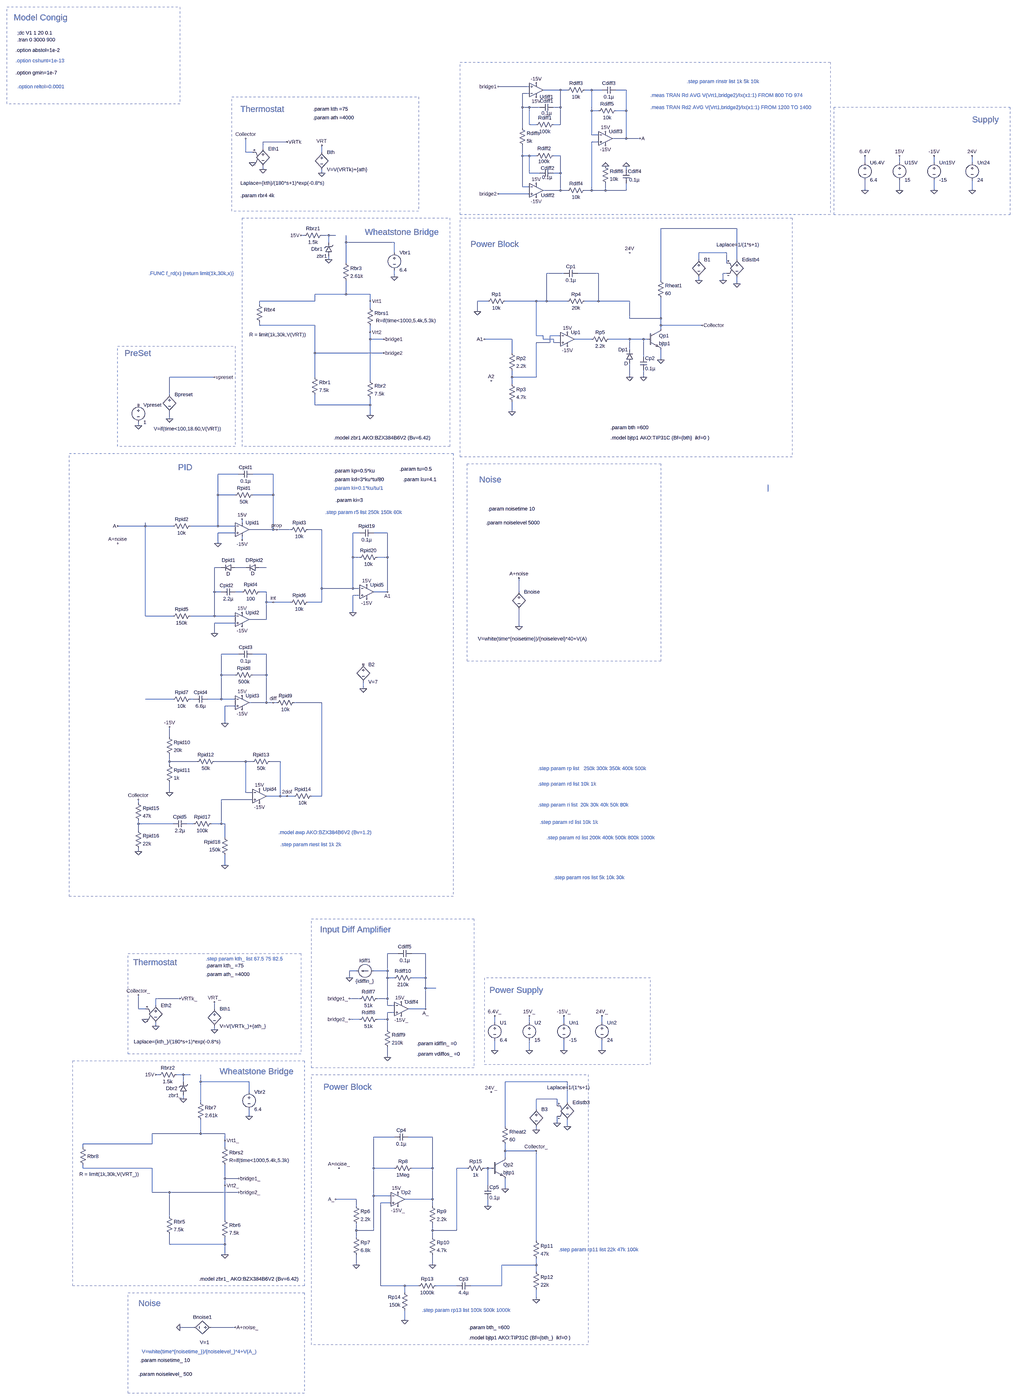
[diagram p0: schematic pid_temp1.asc, whole sheet]
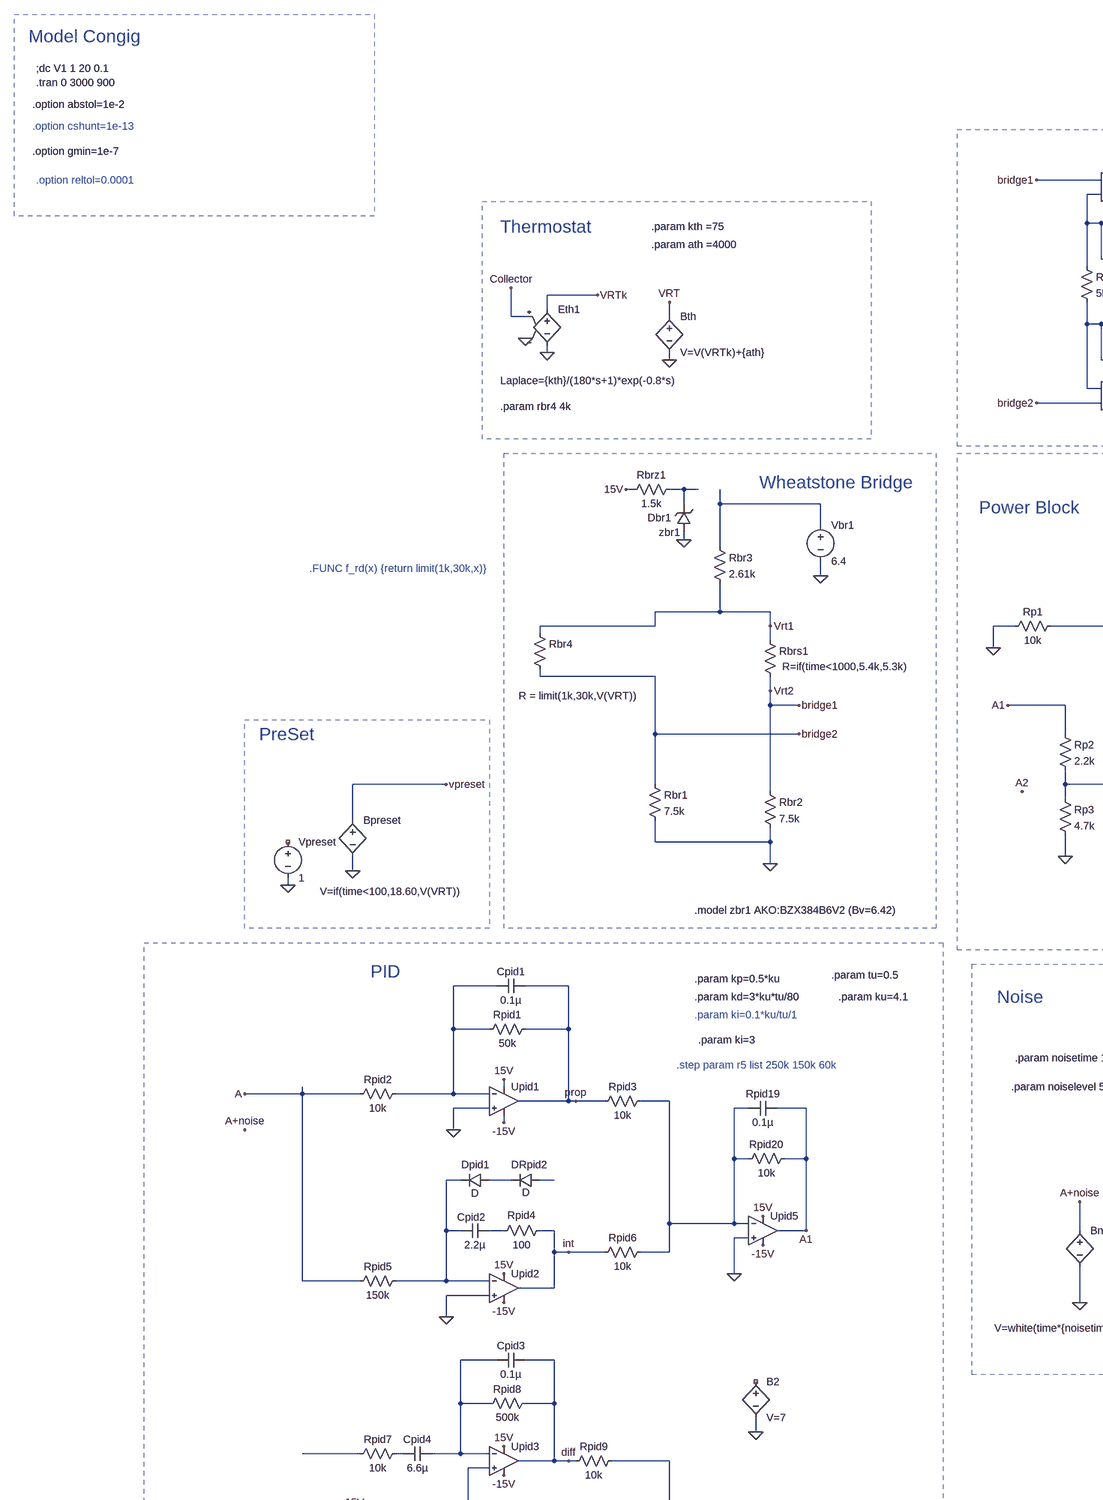
[diagram p1: schematic pid_temp1.asc, part, row 1 of 2, column 1 of 2]
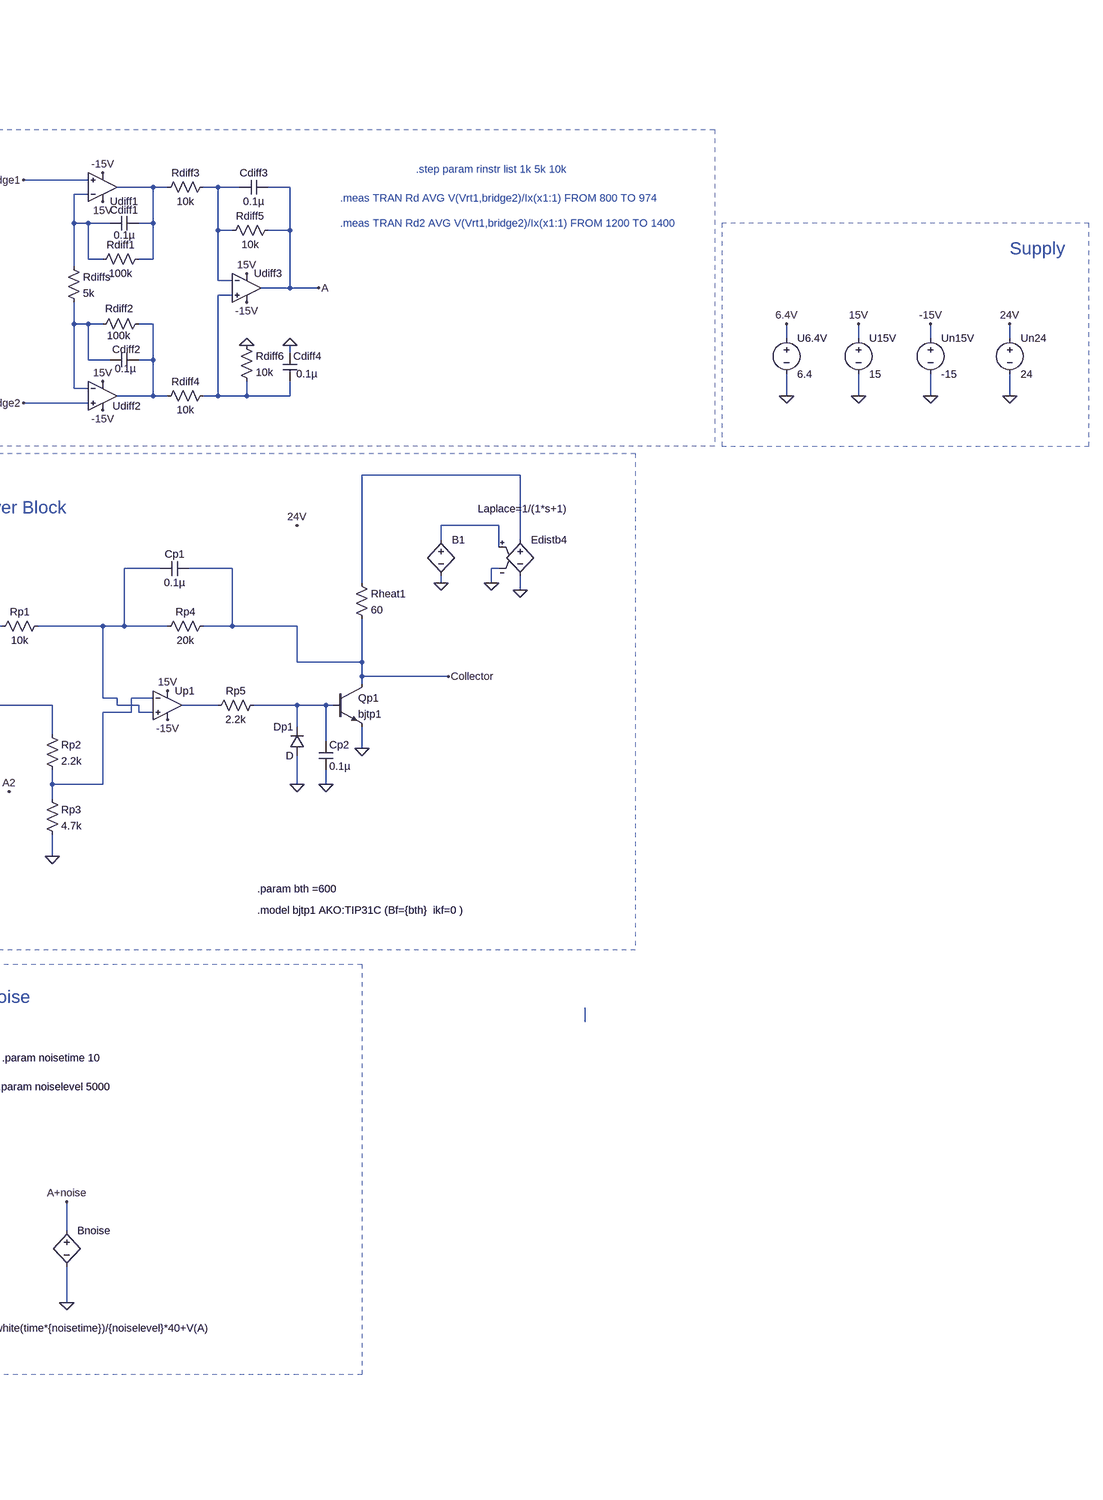
[diagram p2: schematic pid_temp1.asc, part, row 1 of 2, column 2 of 2]
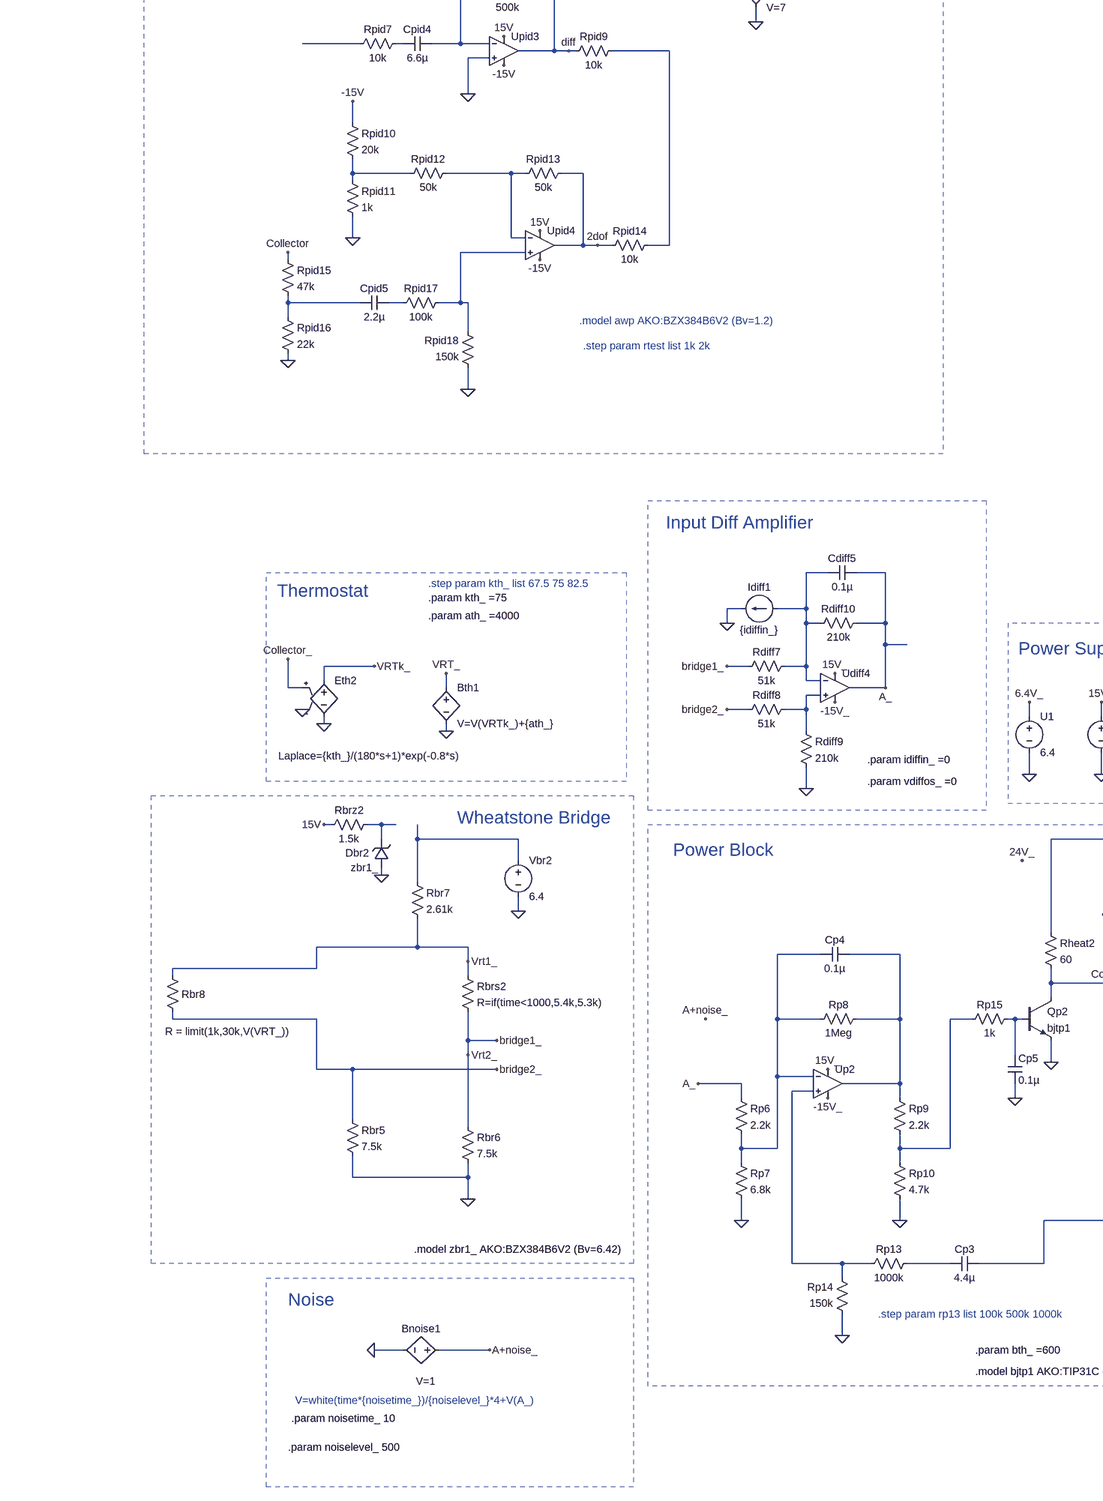
[diagram p3: schematic pid_temp1.asc, part, row 2 of 2, column 1 of 2]
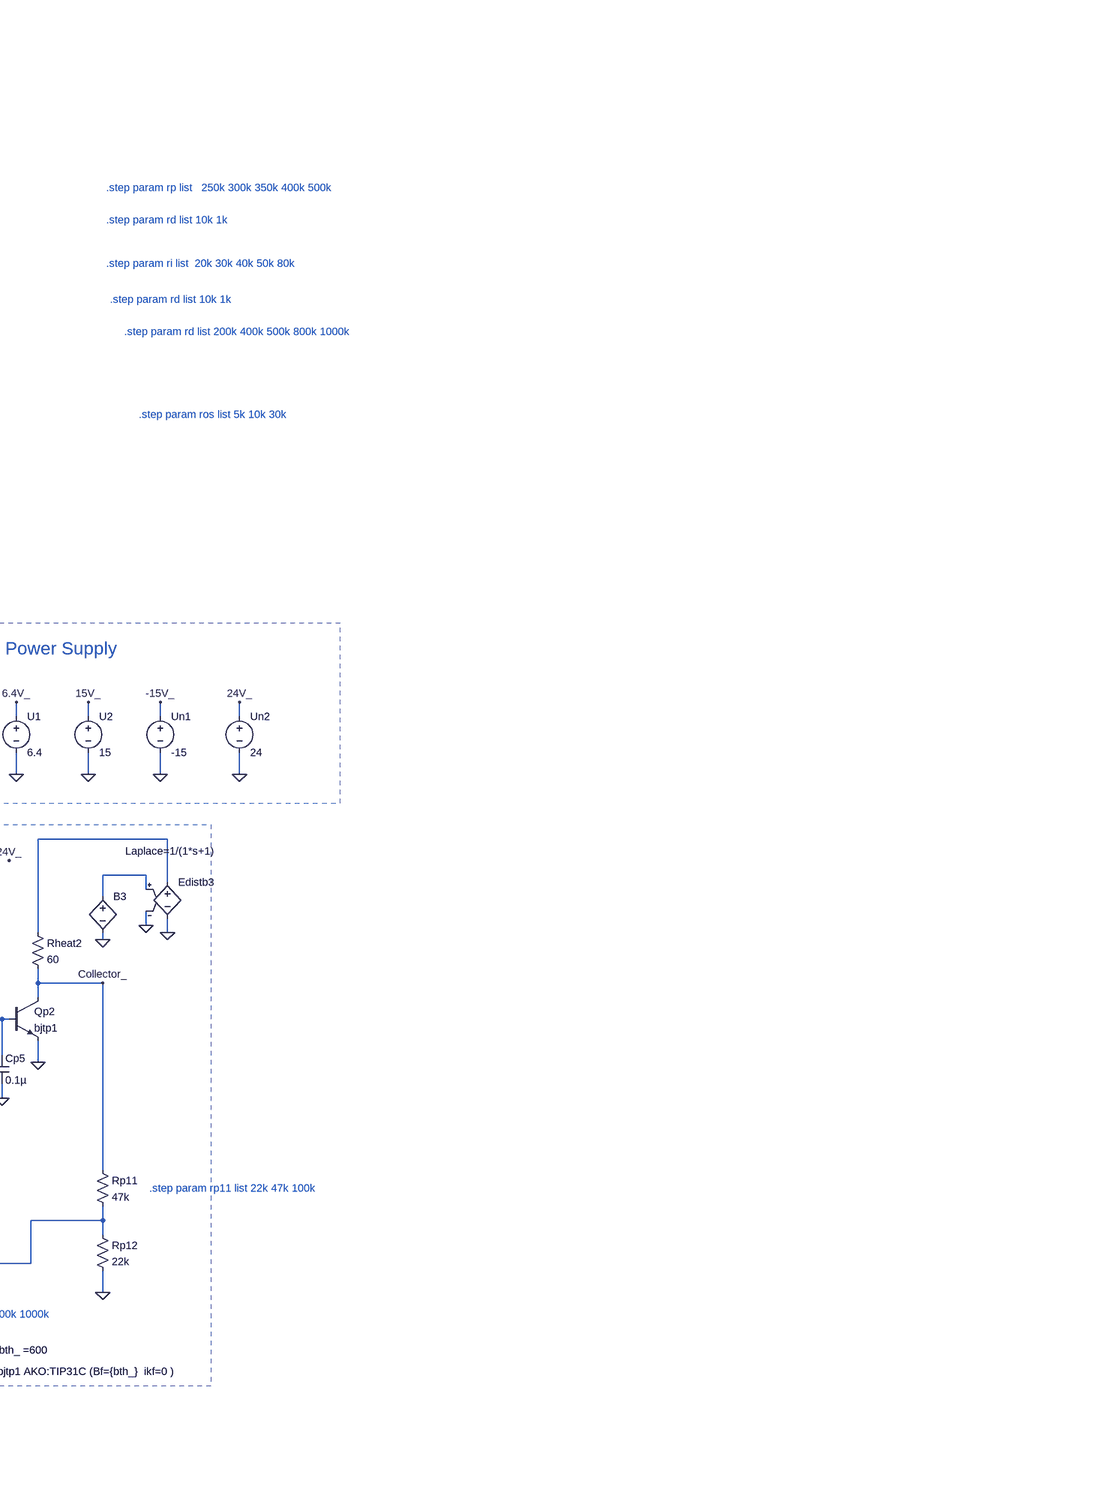
[diagram p4: schematic pid_temp1.asc, part, row 2 of 2, column 2 of 2]
pid_temp1.asc, the LTspice schematic file:
Version 4
SHEET 1 1740 5892
WIRE -720 -864 -864 -864
WIRE -576 -848 -656 -848
WIRE -544 -848 -576 -848
WIRE -432 -848 -464 -848
WIRE -384 -848 -432 -848
WIRE -272 -848 -320 -848
WIRE -720 -832 -752 -832
WIRE -752 -768 -752 -832
WIRE -720 -768 -752 -768
WIRE -672 -768 -720 -768
WIRE -576 -768 -576 -848
WIRE -576 -768 -608 -768
WIRE -432 -752 -432 -848
WIRE -400 -752 -432 -752
WIRE -272 -752 -272 -848
WIRE -272 -752 -320 -752
WIRE -720 -688 -720 -768
WIRE -688 -688 -720 -688
WIRE -576 -688 -576 -768
WIRE -576 -688 -608 -688
WIRE -752 -672 -752 -768
WIRE -432 -640 -432 -752
WIRE -400 -640 -432 -640
WIRE -272 -624 -272 -752
WIRE -272 -624 -336 -624
WIRE -208 -624 -272 -624
WIRE -1840 -608 -1952 -608
WIRE -400 -608 -432 -608
WIRE -1952 -576 -1952 -608
WIRE -2032 -560 -2032 -624
WIRE -2000 -560 -2032 -560
WIRE -1680 -560 -1680 -592
WIRE -752 -544 -752 -592
WIRE -720 -544 -752 -544
WIRE -688 -544 -720 -544
WIRE -576 -544 -608 -544
WIRE 832 -512 832 -544
WIRE 992 -512 992 -544
WIRE 1152 -512 1152 -544
WIRE 1328 -512 1328 -544
WIRE -1952 -480 -1952 -496
WIRE -272 -480 -272 -496
WIRE -1680 -464 -1680 -480
WIRE -720 -464 -720 -544
WIRE -672 -464 -720 -464
WIRE -576 -464 -576 -544
WIRE -576 -464 -608 -464
WIRE -752 -400 -752 -544
WIRE -720 -400 -752 -400
WIRE -576 -384 -576 -464
WIRE -576 -384 -656 -384
WIRE -544 -384 -576 -384
WIRE -432 -384 -432 -608
WIRE -432 -384 -464 -384
WIRE -368 -384 -368 -416
WIRE -368 -384 -432 -384
WIRE -272 -384 -272 -416
WIRE -272 -384 -368 -384
WIRE 832 -384 832 -432
WIRE 992 -384 992 -432
WIRE 1152 -384 1152 -432
WIRE 1328 -384 1328 -432
WIRE -720 -368 -864 -368
WIRE 240 -208 -112 -208
WIRE -1760 -176 -1776 -176
WIRE -1648 -176 -1680 -176
WIRE -1616 -176 -1648 -176
WIRE -1648 -144 -1648 -176
WIRE -1568 -144 -1568 -176
WIRE -1344 -144 -1568 -144
WIRE -1344 -96 -1344 -144
WIRE 192 -96 64 -96
WIRE -1648 -64 -1648 -80
WIRE 64 -64 64 -96
WIRE 240 -64 240 -208
WIRE -1568 -48 -1568 -144
WIRE 192 -48 192 -96
WIRE -560 0 -640 0
WIRE -400 0 -496 0
WIRE 192 0 176 0
WIRE -1344 16 -1344 -16
WIRE -112 32 -112 -208
WIRE 64 32 64 16
WIRE 176 32 176 0
WIRE 240 48 240 16
WIRE -1568 96 -1568 32
WIRE -1568 96 -1712 96
WIRE -1456 96 -1568 96
WIRE -1712 128 -1712 96
WIRE -1712 128 -1968 128
WIRE -1456 128 -1456 96
WIRE -912 128 -960 128
WIRE -688 128 -832 128
WIRE -640 128 -640 0
WIRE -640 128 -688 128
WIRE -544 128 -640 128
WIRE -400 128 -400 0
WIRE -400 128 -464 128
WIRE -256 128 -400 128
WIRE -1968 144 -1968 128
WIRE -1456 160 -1456 128
WIRE -960 176 -960 128
WIRE -256 208 -256 128
WIRE -112 208 -112 112
WIRE -112 208 -256 208
WIRE -1968 240 -1968 224
WIRE -1712 240 -1968 240
WIRE -112 240 -112 208
WIRE 80 240 -112 240
WIRE -112 256 -112 240
WIRE -1456 272 -1456 240
WIRE -688 288 -688 128
WIRE -656 288 -688 288
WIRE -576 288 -624 288
WIRE -1456 304 -1456 272
WIRE -1392 304 -1456 304
WIRE -800 304 -928 304
WIRE -656 304 -656 288
WIRE -608 304 -656 304
WIRE -432 304 -512 304
WIRE -256 304 -352 304
WIRE -192 304 -256 304
WIRE -176 304 -192 304
WIRE -624 320 -624 288
WIRE -624 320 -688 320
WIRE -608 320 -608 304
WIRE -576 320 -608 320
WIRE -256 352 -256 304
WIRE -1712 368 -1712 240
WIRE -1392 368 -1712 368
WIRE -800 368 -800 304
WIRE -192 384 -192 304
WIRE -112 400 -112 352
WIRE -2176 480 -2384 480
WIRE -1712 480 -1712 368
WIRE -800 480 -800 448
WIRE -688 480 -688 320
WIRE -688 480 -800 480
WIRE -256 480 -256 416
WIRE -192 480 -192 448
WIRE -1456 496 -1456 304
WIRE -800 512 -800 480
WIRE -2384 560 -2384 480
WIRE -1712 608 -1712 560
WIRE -1456 608 -1456 576
WIRE -1456 608 -1712 608
WIRE -800 640 -800 592
WIRE -1456 656 -1456 608
WIRE -2384 672 -2384 640
WIRE -2528 704 -2528 688
WIRE -2064 928 -2160 928
WIRE -1904 928 -2000 928
WIRE 384 1008 384 976
WIRE -2160 1024 -2160 928
WIRE -2080 1024 -2160 1024
WIRE -1904 1024 -1904 928
WIRE -1904 1024 -2000 1024
WIRE -2048 1152 -2048 1136
WIRE -2496 1168 -2496 1152
WIRE -2496 1168 -2624 1168
WIRE -2368 1168 -2496 1168
WIRE -2160 1168 -2160 1024
WIRE -2160 1168 -2288 1168
WIRE -2080 1168 -2160 1168
WIRE -1904 1184 -1904 1024
WIRE -1904 1184 -2016 1184
WIRE -1888 1184 -1904 1184
WIRE -1824 1184 -1888 1184
WIRE -1680 1184 -1744 1184
WIRE -2080 1200 -2160 1200
WIRE -1504 1200 -1536 1200
WIRE -1376 1200 -1440 1200
WIRE -2048 1232 -2048 1216
WIRE -2160 1248 -2160 1200
WIRE -1536 1312 -1536 1200
WIRE -1504 1312 -1536 1312
WIRE -1376 1312 -1376 1200
WIRE -1376 1312 -1424 1312
WIRE -2144 1360 -2176 1360
WIRE -2032 1360 -2080 1360
WIRE -1936 1360 -1968 1360
WIRE -1680 1456 -1680 1184
WIRE -1536 1456 -1536 1312
WIRE -1536 1456 -1680 1456
WIRE -1504 1456 -1536 1456
WIRE -2176 1472 -2176 1360
WIRE -2144 1472 -2176 1472
WIRE -2048 1472 -2080 1472
WIRE -1936 1472 -1968 1472
WIRE -1376 1472 -1376 1312
WIRE -1376 1472 -1440 1472
WIRE -768 1472 -768 1408
WIRE -1504 1488 -1536 1488
WIRE -1936 1520 -1936 1472
WIRE -1904 1520 -1936 1520
WIRE -1824 1520 -1904 1520
WIRE -1680 1520 -1680 1456
WIRE -1680 1520 -1744 1520
WIRE -1536 1568 -1536 1488
WIRE -2496 1584 -2496 1168
WIRE -2368 1584 -2496 1584
WIRE -2176 1584 -2176 1472
WIRE -2176 1584 -2288 1584
WIRE -2080 1584 -2176 1584
WIRE -1936 1600 -1936 1520
WIRE -1936 1600 -2016 1600
WIRE -2080 1616 -2176 1616
WIRE -768 1632 -768 1552
WIRE -2176 1664 -2176 1616
WIRE -2064 1760 -2144 1760
WIRE -1936 1760 -2000 1760
WIRE -2144 1856 -2144 1760
WIRE -2080 1856 -2144 1856
WIRE -1936 1856 -1936 1760
WIRE -1936 1856 -2000 1856
WIRE -1488 1920 -1488 1888
WIRE -2368 1968 -2496 1968
WIRE -2272 1968 -2288 1968
WIRE -2144 1968 -2144 1856
WIRE -2144 1968 -2208 1968
WIRE -2080 1968 -2144 1968
WIRE -1936 1984 -1936 1856
WIRE -1936 1984 -2016 1984
WIRE -1904 1984 -1936 1984
WIRE -1888 1984 -1904 1984
WIRE -1680 1984 -1808 1984
WIRE -2080 2000 -2128 2000
WIRE -2128 2080 -2128 2000
WIRE -2384 2144 -2384 2096
WIRE -2384 2256 -2384 2224
WIRE -2256 2256 -2384 2256
WIRE -2032 2256 -2176 2256
WIRE -2000 2256 -2032 2256
WIRE -1872 2256 -1920 2256
WIRE -2384 2272 -2384 2256
WIRE -2384 2400 -2384 2352
WIRE -2032 2400 -2032 2256
WIRE -2000 2400 -2032 2400
WIRE -1872 2416 -1872 2256
WIRE -1872 2416 -1936 2416
WIRE -1840 2416 -1872 2416
WIRE -1808 2416 -1840 2416
WIRE -1680 2416 -1680 1984
WIRE -1680 2416 -1728 2416
WIRE -2000 2432 -2144 2432
WIRE -2528 2448 -2528 2432
WIRE -2528 2544 -2528 2528
WIRE -2368 2544 -2528 2544
WIRE -2272 2544 -2304 2544
WIRE -2144 2544 -2144 2432
WIRE -2144 2544 -2192 2544
WIRE -2128 2544 -2144 2544
WIRE -2528 2576 -2528 2544
WIRE -2128 2608 -2128 2544
WIRE -2528 2672 -2528 2656
WIRE -2128 2736 -2128 2688
WIRE -1328 3744 -1376 3744
WIRE -1200 3744 -1264 3744
WIRE -1520 3824 -1552 3824
WIRE -1376 3824 -1376 3744
WIRE -1376 3824 -1440 3824
WIRE -1552 3856 -1552 3824
WIRE -1376 3856 -1376 3824
WIRE -1344 3856 -1376 3856
WIRE -1200 3856 -1200 3744
WIRE -1200 3856 -1264 3856
WIRE -1200 3904 -1200 3856
WIRE -1152 3904 -1200 3904
WIRE -2336 3952 -2448 3952
WIRE -1504 3952 -1552 3952
WIRE -1376 3952 -1376 3856
WIRE -1376 3952 -1424 3952
WIRE -2448 3984 -2448 3952
WIRE -1376 3984 -1376 3952
WIRE -1344 3984 -1376 3984
WIRE -2528 4000 -2528 3936
WIRE -2496 4000 -2528 4000
WIRE -2176 4000 -2176 3968
WIRE -1200 4000 -1200 3904
WIRE -1200 4000 -1280 4000
WIRE -1344 4016 -1376 4016
WIRE -1504 4048 -1552 4048
WIRE -1376 4048 -1376 4016
WIRE -1376 4048 -1424 4048
WIRE -880 4064 -880 4032
WIRE -720 4064 -720 4032
WIRE -560 4064 -560 4032
WIRE -384 4064 -384 4032
WIRE -2448 4080 -2448 4064
WIRE -2176 4096 -2176 4080
WIRE -1376 4096 -1376 4048
WIRE -880 4192 -880 4144
WIRE -720 4192 -720 4144
WIRE -560 4192 -560 4144
WIRE -384 4192 -384 4144
WIRE -1376 4224 -1376 4176
WIRE -2432 4304 -2448 4304
WIRE -2320 4304 -2352 4304
WIRE -2288 4304 -2320 4304
WIRE -2320 4336 -2320 4304
WIRE -2240 4336 -2240 4304
WIRE -2016 4336 -2240 4336
WIRE -544 4336 -832 4336
WIRE -2016 4384 -2016 4336
WIRE -2320 4416 -2320 4400
WIRE -592 4416 -688 4416
WIRE -2240 4432 -2240 4336
WIRE -544 4432 -544 4336
WIRE -592 4448 -592 4416
WIRE -688 4464 -688 4416
WIRE -2016 4496 -2016 4464
WIRE -592 4528 -592 4496
WIRE -832 4544 -832 4336
WIRE -544 4544 -544 4512
WIRE -688 4560 -688 4544
WIRE -2240 4576 -2240 4512
WIRE -2240 4576 -2464 4576
WIRE -2128 4576 -2240 4576
WIRE -1344 4592 -1440 4592
WIRE -1168 4592 -1280 4592
WIRE -2128 4608 -2128 4576
WIRE -2464 4624 -2464 4576
WIRE -2464 4624 -2784 4624
WIRE -2784 4640 -2784 4624
WIRE -2128 4640 -2128 4608
WIRE -832 4656 -832 4624
WIRE -688 4656 -832 4656
WIRE -832 4688 -832 4656
WIRE -2784 4736 -2784 4720
WIRE -2464 4736 -2784 4736
WIRE -1440 4736 -1440 4592
WIRE -1344 4736 -1440 4736
WIRE -1168 4736 -1168 4592
WIRE -1168 4736 -1264 4736
WIRE -1008 4736 -1056 4736
WIRE -912 4736 -928 4736
WIRE -896 4736 -912 4736
WIRE -2128 4784 -2128 4720
WIRE -2064 4784 -2128 4784
WIRE -2128 4816 -2128 4784
WIRE -912 4816 -912 4736
WIRE -832 4832 -832 4784
WIRE -2464 4848 -2464 4736
WIRE -2384 4848 -2464 4848
WIRE -2064 4848 -2384 4848
WIRE -1440 4864 -1440 4736
WIRE -1360 4864 -1440 4864
WIRE -1520 4880 -1616 4880
WIRE -1168 4880 -1168 4736
WIRE -1168 4880 -1296 4880
WIRE -1360 4896 -1408 4896
WIRE -1520 4912 -1520 4880
WIRE -1168 4912 -1168 4880
WIRE -912 4912 -912 4880
WIRE -2384 4960 -2384 4848
WIRE -2128 4976 -2128 4816
WIRE -1520 5024 -1520 4992
WIRE -1440 5024 -1440 4864
WIRE -1440 5024 -1520 5024
WIRE -1168 5024 -1168 4992
WIRE -1056 5024 -1056 4736
WIRE -1056 5024 -1168 5024
WIRE -1520 5056 -1520 5024
WIRE -1168 5056 -1168 5024
WIRE -688 5072 -688 4656
WIRE -2384 5088 -2384 5040
WIRE -2128 5088 -2128 5056
WIRE -2128 5088 -2384 5088
WIRE -2128 5136 -2128 5088
WIRE -1520 5184 -1520 5136
WIRE -1168 5184 -1168 5136
WIRE -688 5184 -688 5152
WIRE -688 5184 -848 5184
WIRE -688 5216 -688 5184
WIRE -1408 5280 -1408 4896
WIRE -1296 5280 -1408 5280
WIRE -1232 5280 -1296 5280
WIRE -1056 5280 -1152 5280
WIRE -848 5280 -848 5184
WIRE -848 5280 -992 5280
WIRE -1296 5312 -1296 5280
WIRE -688 5344 -688 5296
WIRE -1296 5440 -1296 5392
WIRE -2272 5472 -2336 5472
WIRE -2080 5472 -2192 5472
FLAG 832 -384 0
FLAG 832 -544 6.4V
FLAG 992 -384 0
FLAG 992 -544 15V
FLAG 1152 -384 0
FLAG 1152 -544 -15V
FLAG -688 -416 15V
FLAG -688 -352 -15V
FLAG 1328 -384 0
FLAG 1328 -544 24V
FLAG -864 -864 bridge1
FLAG -864 -368 bridge2
FLAG -208 -624 A
FLAG -928 304 A1
FLAG -1376 1472 A1
FLAG -2624 1168 A
FLAG -2048 1232 -15V
FLAG -2048 1136 15V
FLAG -2048 1632 -15V
FLAG -2048 1568 15V
FLAG -2048 2016 -15V
FLAG -2048 1952 15V
FLAG -1472 1504 -15V
FLAG -1472 1440 15V
FLAG -2160 1248 0
FLAG -2176 1664 0
FLAG -2128 2080 0
FLAG -800 640 0
FLAG -112 400 0
FLAG -256 -96 24V
FLAG -192 480 0
FLAG 80 240 Collector
FLAG -544 336 -15V
FLAG -544 272 15V
FLAG -896 496 A2
FLAG -256 480 0
FLAG -960 176 0
FLAG -2384 672 0
FLAG -2528 704 0
FLAG -1904 1520 int
FLAG -1888 1184 prop
FLAG -1904 1984 diff
FLAG -2176 480 vpreset
FLAG -1968 2448 -15V
FLAG -1968 2384 15V
FLAG -2384 2400 0
FLAG -368 -496 0
FLAG -272 -496 0
FLAG -688 -816 15V
FLAG -688 -880 -15V
FLAG -368 -592 -15V
FLAG -368 -656 15V
FLAG -2384 2096 -15V
FLAG -2528 2432 Collector
FLAG -2128 2736 0
FLAG -2528 2672 0
FLAG -1840 2416 2dof
FLAG -1536 1568 0
FLAG -768 1632 0
FLAG -768 1408 A+noise
FLAG -2624 1248 A+noise
FLAG -2000 -512 0
FLAG -1952 -480 0
FLAG -1840 -608 VRTk
FLAG -2032 -624 Collector
FLAG -1680 -464 0
FLAG -1680 -592 VRT
FLAG -1456 656 0
FLAG -1392 304 bridge1
FLAG -1392 368 bridge2
FLAG -1456 128 Vrt1
FLAG -1456 272 Vrt2
FLAG -1776 -176 15V
FLAG -1648 -64 0
FLAG -1344 16 0
FLAG 64 32 0
FLAG -1488 1920 0
FLAG -880 4192 0
FLAG -880 4032 6.4V_
FLAG -2128 5136 0
FLAG -720 4192 0
FLAG -720 4032 15V_
FLAG -560 4192 0
FLAG -560 4032 -15V_
FLAG -1312 3968 15V_
FLAG -1312 4032 -15V_
FLAG -1376 4224 0
FLAG -1520 5184 0
FLAG -1328 4912 -15V_
FLAG -1328 4848 15V_
FLAG -1168 5184 0
FLAG -832 4832 0
FLAG -384 4192 0
FLAG -384 4032 24V_
FLAG -688 5344 0
FLAG -1296 5440 0
FLAG -912 4912 0
FLAG -2064 4784 bridge1_
FLAG -2064 4848 bridge2_
FLAG -1552 3952 bridge1_
FLAG -1552 4048 bridge2_
FLAG -1200 4000 A_
FLAG -1616 4880 A_
FLAG -688 4656 Collector_
FLAG -2496 4048 0
FLAG -2448 4080 0
FLAG -2336 3952 VRTk_
FLAG -2528 3936 Collector_
FLAG -2128 4608 Vrt1_
FLAG -2128 4816 Vrt2_
FLAG -2448 4304 15V
FLAG -2320 4416 0
FLAG -688 4560 0
FLAG -896 4384 24V_
FLAG -2016 4496 0
FLAG -2336 5472 0
FLAG -2080 5472 A+noise_
FLAG -1600 4736 A+noise_
FLAG -2176 4096 0
FLAG -2176 3968 VRT_
FLAG -1552 3856 0
FLAG -592 4528 0
FLAG -544 4544 0
FLAG 176 32 0
FLAG 240 48 0
DATAFLAG -16 240 ""
DATAFLAG -1696 2416 ""
DATAFLAG -2368 4848 ""
DATAFLAG -2096 4784 ""
DATAFLAG -1152 3904 ""
DATAFLAG -688 4800 ""
DATAFLAG -1520 5024 ""
DATAFLAG -688 5184 ""
SYMBOL voltage 832 -528 R0
WINDOW 123 0 0 Left 0
WINDOW 39 0 0 Left 0
SYMATTR InstName U6.4V
SYMATTR Value 6.4
SYMBOL voltage 992 -528 R0
WINDOW 123 0 0 Left 0
WINDOW 39 0 0 Left 0
SYMATTR InstName U15V
SYMATTR Value 15
SYMBOL voltage 1152 -528 R0
WINDOW 123 0 0 Left 0
WINDOW 39 0 0 Left 0
SYMATTR InstName Un15V
SYMATTR Value -15
SYMBOL voltage 1328 -528 R0
WINDOW 123 0 0 Left 0
WINDOW 39 0 0 Left 0
SYMATTR InstName Un24
SYMATTR Value 24
SYMBOL res -1984 1008 R90
WINDOW 0 0 56 VBottom 2
WINDOW 3 32 56 VTop 2
SYMATTR InstName Rpid1
SYMATTR Value 50k
SYMBOL res -2272 1152 R90
WINDOW 0 0 56 VBottom 2
WINDOW 3 32 56 VTop 2
SYMATTR InstName Rpid2
SYMATTR Value 10k
SYMBOL cap -2080 1456 R90
WINDOW 0 2 40 VBottom 2
WINDOW 3 32 32 VTop 2
SYMATTR InstName Cpid2
SYMATTR Value 2.2µ
SYMBOL cap -2208 1952 R90
WINDOW 0 0 32 VBottom 2
WINDOW 3 32 32 VTop 2
SYMATTR InstName Cpid4
SYMATTR Value 6.6µ
SYMBOL res -2272 1568 R90
WINDOW 0 0 56 VBottom 2
WINDOW 3 32 56 VTop 2
SYMATTR InstName Rpid5
SYMATTR Value 150k
SYMBOL res -1984 1840 R90
WINDOW 0 0 56 VBottom 2
WINDOW 3 32 56 VTop 2
SYMATTR InstName Rpid8
SYMATTR Value 500k
SYMBOL res -1408 1296 R90
WINDOW 0 0 56 VBottom 2
WINDOW 3 32 56 VTop 2
SYMATTR InstName Rpid20
SYMATTR Value 10k
SYMBOL res -1728 1168 R90
WINDOW 0 0 56 VBottom 2
WINDOW 3 32 56 VTop 2
SYMATTR InstName Rpid3
SYMATTR Value 10k
SYMBOL res -1728 1504 R90
WINDOW 0 0 56 VBottom 2
WINDOW 3 32 56 VTop 2
SYMATTR InstName Rpid6
SYMATTR Value 10k
SYMBOL res -1792 1968 R90
WINDOW 0 0 56 VBottom 2
WINDOW 3 32 56 VTop 2
SYMATTR InstName Rpid9
SYMATTR Value 10k
SYMBOL res -2272 1952 R90
WINDOW 0 0 56 VBottom 2
WINDOW 3 32 56 VTop 2
SYMATTR InstName Rpid7
SYMATTR Value 10k
SYMBOL cap -2000 1744 R90
WINDOW 0 0 32 VBottom 2
WINDOW 3 32 32 VTop 2
SYMATTR InstName Cpid3
SYMATTR Value 0.1µ
SYMBOL cap -2000 912 R90
WINDOW 0 0 32 VBottom 2
WINDOW 3 32 32 VTop 2
SYMATTR InstName Cpid1
SYMATTR Value 0.1µ
SYMBOL cap -1440 1184 R90
WINDOW 0 0 32 VBottom 2
WINDOW 3 32 32 VTop 2
SYMATTR InstName Rpid19
SYMATTR Value 0.1µ
SYMBOL res -816 352 R0
SYMATTR InstName Rp2
SYMATTR Value 2.2k
SYMBOL res -816 496 R0
SYMATTR InstName Rp3
SYMATTR Value 4.7k
SYMBOL npn -176 256 R0
SYMATTR InstName Qp1
SYMATTR Value bjtp1
SYMBOL res -128 16 R0
SYMATTR InstName Rheat1
SYMATTR Value 60
SYMBOL res -336 288 R90
WINDOW 0 0 56 VBottom 2
WINDOW 3 32 56 VTop 2
SYMATTR InstName Rp5
SYMATTR Value 2.2k
SYMBOL cap -208 384 R0
SYMATTR InstName Cp2
SYMATTR Value 0.1µ
SYMBOL diode -240 416 R180
WINDOW 0 24 64 Left 2
WINDOW 3 24 0 Left 2
SYMATTR InstName Dp1
SYMBOL res -448 112 R90
WINDOW 0 0 56 VBottom 2
WINDOW 3 32 56 VTop 2
SYMATTR InstName Rp4
SYMATTR Value 20k
SYMBOL res -816 112 R90
WINDOW 0 0 56 VBottom 2
WINDOW 3 32 56 VTop 2
SYMATTR InstName Rp1
SYMATTR Value 10k
SYMBOL cap -496 -16 R90
WINDOW 0 0 32 VBottom 2
WINDOW 3 32 32 VTop 2
SYMATTR InstName Cp1
SYMATTR Value 0.1µ
SYMBOL bv -2384 544 R0
WINDOW 3 -73 174 Left 2
SYMATTR Value V=if(time<100,18.60,V(VRT))
SYMATTR InstName Bpreset
SYMBOL voltage -2528 592 R0
WINDOW 123 0 0 Left 0
WINDOW 39 0 0 Left 0
SYMATTR InstName Vpreset
SYMATTR Value 1
SYMBOL diode -2080 1344 R90
WINDOW 0 -3 31 VBottom 2
WINDOW 3 29 32 VTop 2
SYMATTR InstName Dpid1
SYMBOL res -1904 2240 R90
WINDOW 0 0 56 VBottom 2
WINDOW 3 32 56 VTop 2
SYMATTR InstName Rpid13
SYMATTR Value 50k
SYMBOL res -1712 2400 R90
WINDOW 0 0 56 VBottom 2
WINDOW 3 32 56 VTop 2
SYMATTR InstName Rpid14
SYMATTR Value 10k
SYMBOL res -768 -688 R0
SYMATTR InstName Rdiffs
SYMATTR Value 5k
SYMBOL res -592 -704 R90
WINDOW 0 0 56 VBottom 2
WINDOW 3 32 56 VTop 2
SYMATTR InstName Rdiff1
SYMATTR Value 100k
SYMBOL res -592 -560 R90
WINDOW 0 -2 59 VBottom 2
WINDOW 3 27 60 VTop 2
SYMATTR InstName Rdiff2
SYMATTR Value 100k
SYMBOL cap -608 -784 R90
WINDOW 0 3 32 VBottom 2
WINDOW 3 27 32 VTop 2
SYMATTR InstName Cdiff1
SYMATTR Value 0.1µ
SYMBOL cap -608 -480 R90
WINDOW 0 9 27 VBottom 2
WINDOW 3 20 29 VTop 2
SYMATTR InstName Cdiff2
SYMATTR Value 0.1µ
SYMBOL res -448 -864 R90
WINDOW 0 0 56 VBottom 2
WINDOW 3 32 56 VTop 2
SYMATTR InstName Rdiff3
SYMATTR Value 10k
SYMBOL res -448 -400 R90
WINDOW 0 0 56 VBottom 2
WINDOW 3 32 56 VTop 2
SYMATTR InstName Rdiff4
SYMATTR Value 10k
SYMBOL res -384 -512 R0
SYMATTR InstName Rdiff6
SYMATTR Value 10k
SYMBOL res -304 -768 R90
WINDOW 0 0 56 VBottom 2
WINDOW 3 32 56 VTop 2
SYMATTR InstName Rdiff5
SYMATTR Value 10k
SYMBOL cap -288 -480 R0
WINDOW 3 30 47 Left 2
SYMATTR Value 0.1µ
SYMATTR InstName Cdiff4
SYMBOL cap -320 -864 R90
WINDOW 0 0 32 VBottom 2
WINDOW 3 32 32 VTop 2
SYMATTR InstName Cdiff3
SYMATTR Value 0.1µ
SYMBOL res -1952 1456 R90
WINDOW 0 -2 57 VBottom 2
WINDOW 3 32 56 VTop 2
SYMATTR InstName Rpid4
SYMATTR Value 100
SYMBOL res -2400 2128 R0
SYMATTR InstName Rpid10
SYMATTR Value 20k
SYMBOL res -2400 2256 R0
SYMATTR InstName Rpid11
SYMATTR Value 1k
SYMBOL cap -2304 2528 R90
WINDOW 0 0 32 VBottom 2
WINDOW 3 32 32 VTop 2
SYMATTR InstName Cpid5
SYMATTR Value 2.2µ
SYMBOL res -2176 2528 R90
WINDOW 0 0 56 VBottom 2
WINDOW 3 32 56 VTop 2
SYMATTR InstName Rpid17
SYMATTR Value 100k
SYMBOL res -2112 2704 R180
WINDOW 0 36 76 Left 2
WINDOW 3 36 40 Left 2
SYMATTR InstName Rpid18
SYMATTR Value 150k
SYMBOL res -2544 2432 R0
SYMATTR InstName Rpid15
SYMATTR Value 47k
SYMBOL res -2544 2560 R0
SYMATTR InstName Rpid16
SYMATTR Value 22k
SYMBOL diode -1968 1344 R90
WINDOW 0 -3 24 VBottom 2
WINDOW 3 28 31 VTop 2
SYMATTR InstName DRpid2
SYMBOL res -2160 2240 R90
WINDOW 0 0 56 VBottom 2
WINDOW 3 32 56 VTop 2
SYMATTR InstName Rpid12
SYMATTR Value 50k
SYMBOL bv -768 1456 R0
WINDOW 3 -190 233 Left 2
SYMATTR Value V=white(time*{noisetime})/{noiselevel}*40+V(A)
SYMATTR InstName Bnoise
SYMBOL e -1952 -592 R0
WINDOW 3 -104 174 Left 2
SYMATTR Value Laplace={kth}/(180*s+1)*exp(-0.8*s)
SYMATTR InstName Eth1
SYMBOL bv -1680 -576 R0
SYMATTR InstName Bth
SYMATTR Value V=V(VRTk)+{ath}
SYMBOL res -1728 464 R0
SYMATTR InstName Rbr1
SYMATTR Value 7.5k
SYMBOL res -1472 144 R0
WINDOW 3 43 74 Left 2
SYMATTR Value R=if(time<1000,5.4k,5.3k)
SYMATTR InstName Rbrs1
SYMBOL res -1472 480 R0
SYMATTR InstName Rbr2
SYMATTR Value 7.5k
SYMBOL res -1584 -64 R0
SYMATTR InstName Rbr3
SYMATTR Value 2.61k
SYMBOL zener -1632 -80 R180
WINDOW 0 44 33 Left 2
WINDOW 3 24 0 Left 2
SYMATTR InstName Dbr1
SYMATTR Value zbr1
SYMBOL res -1664 -192 R90
WINDOW 0 0 56 VBottom 2
WINDOW 3 32 56 VTop 2
SYMATTR InstName Rbrz1
SYMATTR Value 1.5k
SYMBOL res -1984 128 R0
WINDOW 3 -31 155 Left 2
SYMATTR Value R = limit(1k,30k,V(VRT))
SYMATTR InstName Rbr4
SYMBOL voltage -1344 -112 R0
WINDOW 123 0 0 Left 0
WINDOW 39 0 0 Left 0
SYMATTR InstName Vbr1
SYMATTR Value 6.4
SYMBOL Opamps\\UniversalOpamp2 -688 -848 M180
SYMATTR InstName Udiff1
SYMATTR Value2 Avol=250k GBW=10Meg Slew=10Meg
SYMBOL Opamps\\UniversalOpamp2 -368 -624 R0
SYMATTR InstName Udiff3
SYMATTR Value2 Avol=250k GBW=10Meg Slew=10Meg
SYMBOL Opamps\\UniversalOpamp2 -688 -384 R0
WINDOW 0 22 23 Left 2
SYMATTR InstName Udiff2
SYMATTR Value2 Avol=250k GBW=10Meg Slew=10Meg
SYMBOL Opamps\\UniversalOpamp2 -544 304 R0
SYMATTR InstName Up1
SYMATTR Value2 Avol=250k GBW=10Meg Slew=10Meg
SYMBOL Opamps\\UniversalOpamp2 -2048 1600 R0
SYMATTR InstName Upid2
SYMATTR Value2 Avol=250k GBW=10Meg Slew=10Meg
SYMBOL Opamps\\UniversalOpamp2 -2048 1984 R0
SYMATTR InstName Upid3
SYMATTR Value2 Avol=250k GBW=10Meg Slew=10Meg
SYMBOL Opamps\\UniversalOpamp2 -1968 2416 R0
SYMATTR InstName Upid4
SYMATTR Value2 Avol=250k GBW=10Meg Slew=10Meg
SYMBOL Opamps\\UniversalOpamp2 -1472 1472 R0
SYMATTR InstName Upid5
SYMATTR Value2 Avol=250k GBW=10Meg Slew=10Meg
SYMBOL Opamps\\UniversalOpamp2 -2048 1184 R0
SYMATTR InstName Upid1
SYMATTR Value2 Avol=250k GBW=10Meg Slew=10Meg
SYMBOL bv 64 -80 R0
WINDOW 3 24 96 Invisible 2
SYMATTR Value V=if(time<2200,24,if(time>2200,if(time<2203,0,24),24))
SYMATTR InstName B1
SYMBOL bv -1488 1792 R0
SYMATTR InstName B2
SYMATTR Value V=7
SYMBOL voltage -880 4048 R0
WINDOW 123 0 0 Left 0
WINDOW 39 0 0 Left 0
SYMATTR InstName U1
SYMATTR Value 6.4
SYMBOL res -2400 4944 R0
SYMATTR InstName Rbr5
SYMATTR Value 7.5k
SYMBOL res -2144 4624 R0
SYMATTR InstName Rbrs2
SYMATTR Value R=if(time<1000,5.4k,5.3k)
SYMBOL res -2144 4960 R0
SYMATTR InstName Rbr6
SYMATTR Value 7.5k
SYMBOL res -2256 4416 R0
SYMATTR InstName Rbr7
SYMATTR Value 2.61k
SYMBOL voltage -720 4048 R0
WINDOW 123 0 0 Left 0
WINDOW 39 0 0 Left 0
SYMATTR InstName U2
SYMATTR Value 15
SYMBOL voltage -560 4048 R0
WINDOW 123 0 0 Left 0
WINDOW 39 0 0 Left 0
SYMATTR InstName Un1
SYMATTR Value -15
SYMBOL res -1408 3936 R90
WINDOW 0 0 56 VBottom 2
WINDOW 3 32 56 VTop 2
SYMATTR InstName Rdiff7
SYMATTR Value 51k
SYMBOL res -1408 4032 R90
WINDOW 0 0 56 VBottom 2
WINDOW 3 32 56 VTop 2
SYMATTR InstName Rdiff8
SYMATTR Value 51k
SYMBOL res -1392 4080 R0
SYMATTR InstName Rdiff9
SYMATTR Value 210k
SYMBOL res -1248 3840 R90
WINDOW 0 0 56 VBottom 2
WINDOW 3 32 56 VTop 2
SYMATTR InstName Rdiff10
SYMATTR Value 210k
SYMBOL res -1536 4896 R0
SYMATTR InstName Rp6
SYMATTR Value 2.2k
SYMBOL res -1536 5040 R0
SYMATTR InstName Rp7
SYMATTR Value 6.8k
SYMBOL res -1248 4720 R90
WINDOW 0 0 56 VBottom 2
WINDOW 3 32 56 VTop 2
SYMATTR InstName Rp8
SYMATTR Value 1Meg
SYMBOL res -1184 4896 R0
SYMATTR InstName Rp9
SYMATTR Value 2.2k
SYMBOL res -1184 5040 R0
SYMATTR InstName Rp10
SYMATTR Value 4.7k
SYMBOL res -848 4528 R0
SYMATTR InstName Rheat2
SYMATTR Value 60
SYMBOL voltage -384 4048 R0
WINDOW 123 0 0 Left 0
WINDOW 39 0 0 Left 0
SYMATTR InstName Un2
SYMATTR Value 24
SYMBOL res -704 5056 R0
SYMATTR InstName Rp11
SYMATTR Value 47k
SYMBOL res -704 5200 R0
SYMATTR InstName Rp12
SYMATTR Value 22k
SYMBOL res -1136 5264 R90
WINDOW 0 0 56 VBottom 2
WINDOW 3 32 56 VTop 2
SYMATTR InstName Rp13
SYMATTR Value 1000k
SYMBOL res -1280 5408 R180
WINDOW 0 36 76 Left 2
WINDOW 3 36 40 Left 2
SYMATTR InstName Rp14
SYMATTR Value 150k
SYMBOL res -912 4720 R90
WINDOW 0 0 56 VBottom 2
WINDOW 3 32 56 VTop 2
SYMATTR InstName Rp15
SYMATTR Value 1k
SYMBOL cap -992 5264 R90
WINDOW 0 0 32 VBottom 2
WINDOW 3 32 32 VTop 2
SYMATTR InstName Cp3
SYMATTR Value 4.4µ
SYMBOL cap -1280 4576 R90
WINDOW 0 0 32 VBottom 2
WINDOW 3 32 32 VTop 2
SYMATTR InstName Cp4
SYMATTR Value 0.1µ
SYMBOL cap -1264 3728 R90
WINDOW 0 0 32 VBottom 2
WINDOW 3 32 32 VTop 2
SYMATTR InstName Cdiff5
SYMATTR Value 0.1µ
SYMBOL cap -928 4816 R0
SYMATTR InstName Cp5
SYMATTR Value 0.1µ
SYMBOL e -2448 3968 R0
WINDOW 3 -101 183 Left 2
SYMATTR Value Laplace={kth_}/(180*s+1)*exp(-0.8*s)
SYMATTR InstName Eth2
SYMBOL zener -2304 4400 R180
WINDOW 0 44 33 Left 2
WINDOW 3 24 0 Left 2
SYMATTR InstName Dbr2
SYMATTR Value zbr1_
SYMBOL res -2336 4288 R90
WINDOW 0 0 56 VBottom 2
WINDOW 3 32 56 VTop 2
SYMATTR InstName Rbrz2
SYMATTR Value 1.5k
SYMBOL res -2800 4624 R0
WINDOW 0 36 57 Left 2
WINDOW 3 -1 140 Left 2
SYMATTR InstName Rbr8
SYMATTR Value R = limit(1k,30k,V(VRT_))
SYMBOL bv -688 4448 R0
WINDOW 3 24 96 Invisible 2
SYMATTR Value V=if(time<2200,24,if(time>2200,if(time<2203,0,24),24))
SYMATTR InstName B3
SYMBOL npn -896 4688 R0
SYMATTR InstName Qp2
SYMATTR Value bjtp1
SYMBOL Opamps\\UniversalOpamp2 -1312 4000 R0
SYMATTR InstName Udiff4
SYMATTR Value2 Avol=250k GBW=10Meg Slew=10Meg
SYMATTR SpiceLine Ilimit=25m Rail=0 Vos={vdiffos_}
SYMBOL voltage -2016 4368 R0
WINDOW 123 0 0 Left 0
WINDOW 39 0 0 Left 0
SYMATTR InstName Vbr2
SYMATTR Value 6.4
SYMBOL bv -2176 5472 R90
WINDOW 3 54 46 VTop 2
WINDOW 0 -32 56 VBottom 2
SYMATTR Value V=1
SYMATTR InstName Bnoise1
SYMBOL Opamps\\UniversalOpamp2 -1328 4880 R0
SYMATTR InstName Up2
SYMATTR Value2 Avol=250k GBW=10Meg Slew=10Meg
SYMBOL bv -2176 3984 R0
SYMATTR InstName Bth1
SYMATTR Value V=V(VRTk_)+{ath_}
SYMBOL current -1440 3824 M270
WINDOW 0 32 40 VTop 2
WINDOW 3 -32 40 VBottom 2
SYMATTR InstName Idiff1
SYMATTR Value {idiffin_}
SYMBOL e -544 4416 R0
WINDOW 3 -94 -53 Left 2
SYMATTR Value Laplace=1/(1*s+1)
SYMATTR InstName Edistb3
SYMBOL e 240 -80 R0
WINDOW 3 -94 -53 Left 2
SYMATTR Value Laplace=1/(1*s+1)
SYMATTR InstName Edistb4
TEXT -3088 -1080 Left 2 !.tran 0 3000 900
TEXT 1328 -712 Left 4 ;Supply
TEXT -992 -136 Left 4 ;Power Block
TEXT -2344 896 Left 4 ;PID
TEXT -1624 912 Left 2 !.param kp=0.5*ku
TEXT -1624 952 Left 2 !.param kd=3*ku*tu/80
TEXT -1624 992 Left 2 ;.param ki=0.1*ku/tu/1
TEXT -1320 904 Left 2 !.param tu=0.5
TEXT -1304 952 Left 2 !.param ku=4.1
TEXT -1616 1048 Left 2 !.param ki=3
TEXT -2592 368 Left 4 ;PreSet
TEXT -3088 -1112 Left 2 !;dc V1 1 20 0.1
TEXT -3096 -1032 Left 2 !.option abstol=1e-2
TEXT -3096 -984 Left 2 ;.option cshunt=1e-13
TEXT -3096 -928 Left 2 !.option gmin=1e-7
TEXT -3088 -864 Left 2 ;.option reltol=0.0001
TEXT -672 2536 Left 2 ;.step param rd list 10k 1k
TEXT 8 -888 Left 2 ;.step param rinstr list 1k 5k 10k
TEXT -1880 2584 Left 2 ;.model awp AKO:BZX384B6V2 (Bv=1.2)
TEXT -1872 2640 Left 2 ;.step param rtest list 1k 2k
TEXT -160 -824 Left 2 ;.meas TRAN Rd AVG V(Vrt1,bridge2)/Ix(x1:1) FROM 800 TO 974
TEXT -160 -768 Left 2 ;.meas TRAN Rd2 AVG V(Vrt1,bridge2)/Ix(x1:1) FROM 1200 TO 1400
TEXT -608 2792 Left 2 ;.step param ros list 5k 10k 30k
TEXT -640 2608 Left 2 ;.step param rd list 200k 400k 500k 800k 1000k
TEXT -680 2360 Left 2 ;.step param rd list 10k 1k
TEXT -680 2456 Left 2 ;.step param ri list  20k 30k 40k 50k 80k
TEXT -680 2288 Left 2 ;.step param rp list   250k 300k 350k 400k 500k
TEXT -1664 1104 Left 2 ;.step param r5 list 250k 150k 60k
TEXT -912 1088 Left 2 !.param noisetime 10
TEXT -920 1152 Left 2 !.param noiselevel 5000
TEXT -952 952 Left 4 ;Noise
TEXT -2056 -760 Left 4 ;Thermostat
TEXT -1720 -760 Left 2 !.param kth =75
TEXT -1720 -720 Left 2 !.param ath =4000
TEXT -1480 -192 Left 4 ;Wheatstone Bridge
TEXT -1624 760 Left 2 !.model zbr1 AKO:BZX384B6V2 (Bv=6.42)
TEXT -3104 -1184 Left 4 ;Model Congig
TEXT -344 760 Left 2 !.model bjtp1 AKO:TIP31C (Bf={bth}  ikf=0 )
TEXT -344 712 Left 2 !.param bth =600
TEXT -2152 4288 Left 4 ;Wheatstone Bridge
TEXT -904 3912 Left 4 ;Power Supply
TEXT -1688 3632 Left 4 ;Input Diff Amplifier
TEXT -2552 3784 Left 4 ;Thermostat
TEXT -1672 4360 Left 4 ;Power Block
TEXT -2248 5248 Left 2 !.model zbr1_ AKO:BZX384B6V2 (Bv=6.42)
TEXT -1000 5520 Left 2 !.model bjtp1 AKO:TIP31C (Bf={bth_}  ikf=0 )
TEXT -2528 5360 Left 4 ;Noise
TEXT -2520 5624 Left 2 !.param noisetime_ 10
TEXT -2528 5688 Left 2 !.param noiselevel_ 500
TEXT -2512 5584 Left 2 ;V=white(time*{noisetime_})/{noiselevel_}*4+V(A_)
TEXT -2216 3800 Left 2 !.param kth_ =75
TEXT -2216 3840 Left 2 !.param ath_ =4000
TEXT -1000 5472 Left 2 !.param bth_ =600
TEXT -1240 4208 Left 2 !.param vdiffos_ =0
TEXT -1240 4160 Left 2 !.param idiffin_ =0
TEXT -2216 3768 Left 2 ;.step param kth_ list 67.5 75 82.5
TEXT -584 5112 Left 2 ;.step param rp11 list 22k 47k 100k
TEXT -1216 5392 Left 2 ;.step param rp13 list 100k 500k 1000k
TEXT -2056 -360 Left 2 !.param rbr4 4k
TEXT -2480 0 Left 2 ;.FUNC f_rd(x) {return limit(1k,30k,x)}
RECTANGLE Normal 1504 -768 688 -272 2
RECTANGLE Normal 672 -272 -1040 -976 2
RECTANGLE Normal 496 848 -1040 -256 2
RECTANGLE Normal -1072 2880 -2848 832 2
RECTANGLE Normal -2624 336 -2080 800 2
RECTANGLE Normal -112 1792 -1008 880 2
RECTANGLE Normal -1232 -288 -2096 -816 2
RECTANGLE Normal -1088 800 -2048 -256 2
RECTANGLE Normal -2336 -784 -3136 -1232 2
RECTANGLE Normal -1760 5280 -2832 4240 2
RECTANGLE Normal -160 3856 -928 4256 2
RECTANGLE Normal -976 4272 -1728 3584 2
RECTANGLE Normal -1776 4208 -2576 3744 2
RECTANGLE Normal -448 5552 -1728 4304 2
RECTANGLE Normal -1760 5776 -2576 5312 2

The netlist it stands for:
* pid_temp1.asc
V§U6.4V 6.4V 0 6.4
V§U15V 15V 0 15
V§Un15V -15V 0 -15
V§Un24 24V 0 24
Rpid1 prop N015 50k
Rpid2 N015 A 10k
Cpid2 N021 N018 2.2µ
Cpid4 N022 N024 6.6µ
Rpid5 N018 A 150k
Rpid8 diff N022 500k
Rpid20 A1 N017 10k
Rpid3 N017 prop 10k
Rpid6 N017 int 10k
Rpid9 N025 diff 10k
Rpid7 N024 N023 10k
Cpid3 diff N022 0.1µ
Cpid1 prop N015 0.1µ
C§Rpid19 A1 N017 0.1µ
Rp2 A1 N012 2.2k
Rp3 N012 0 4.7k
Qp1 Collector N014 0 0 bjtp1
Rheat1 N007 Collector 60
Rp5 N014 N013 2.2k
Cp2 N014 0 0.1µ
Dp1 0 N014 D
Rp4 Collector N011 20k
Rp1 N011 0 10k
Cp1 Collector N011 0.1µ
Bpreset vpreset 0 V=if(time<100,18.60,V(VRT))
Vpreset NC_01 0 1
Dpid1 N019 N018 D
Rpid13 2dof N027 50k
Rpid14 N025 2dof 10k
Rdiffs N003 N005 5k
Rdiff1 N001 N003 100k
Rdiff2 N006 N005 100k
Cdiff1 N001 N003 0.1µ
Cdiff2 N006 N005 0.1µ
Rdiff3 N002 N001 10k
Rdiff4 N004 N006 10k
Rdiff6 0 N004 10k
Rdiff5 A N002 10k
Cdiff4 0 N004 0.1µ
Cdiff3 A N002 0.1µ
Rpid4 int N021 100
Rpid10 -15V N026 20k
Rpid11 N026 0 1k
Cpid5 N030 N029 2.2µ
Rpid17 N028 N030 100k
Rpid18 0 N028 150k
Rpid15 Collector N029 47k
Rpid16 N029 0 22k
DRpid2 N020 N019 D
Rpid12 N027 N026 50k
Bnoise A+noise 0 V=white(time*{noisetime})/{noiselevel}*40+V(A)
Eth1 VRTk 0 Collector 0 Laplace={kth}/(180*s+1)*exp(-0.8*s)
Bth VRT 0 V=V(VRTk)+{ath}
Rbr1 bridge2 0 7.5k
Rbrs1 Vrt1 Vrt2 R=if(time<1000,5.4k,5.3k)
Rbr2 Vrt2 0 7.5k
Rbr3 N009 Vrt1 2.61k
Dbr1 0 N008 zbr1
Rbrz1 N008 15V 1.5k
Rbr4 Vrt1 bridge2 R = limit(1k,30k,V(VRT))
Vbr1 N009 0 6.4
XUdiff1 Vrt2 N003 15V -15V N001 level.2 Avol=250k GBW=10Meg Slew=10Meg ilimit=25m rail=0 Vos=0 phimargin=45 en=0 enk=0 in=0 ink=0 Rin=500Meg  ; pins IN+ IN- V+ V- OUT
XUdiff3 N004 N002 15V -15V A level.2 Avol=250k GBW=10Meg Slew=10Meg ilimit=25m rail=0 Vos=0 phimargin=45 en=0 enk=0 in=0 ink=0 Rin=500Meg  ; pins IN+ IN- V+ V- OUT
XUdiff2 bridge2 N005 15V -15V N006 level.2 Avol=250k GBW=10Meg Slew=10Meg ilimit=25m rail=0 Vos=0 phimargin=45 en=0 enk=0 in=0 ink=0 Rin=500Meg  ; pins IN+ IN- V+ V- OUT
XUp1 N011 N012 15V -15V N013 level.2 Avol=250k GBW=10Meg Slew=10Meg ilimit=25m rail=0 Vos=0 phimargin=45 en=0 enk=0 in=0 ink=0 Rin=500Meg  ; pins IN+ IN- V+ V- OUT
XUpid2 0 N018 15V -15V int level.2 Avol=250k GBW=10Meg Slew=10Meg ilimit=25m rail=0 Vos=0 phimargin=45 en=0 enk=0 in=0 ink=0 Rin=500Meg  ; pins IN+ IN- V+ V- OUT
XUpid3 0 N022 15V -15V diff level.2 Avol=250k GBW=10Meg Slew=10Meg ilimit=25m rail=0 Vos=0 phimargin=45 en=0 enk=0 in=0 ink=0 Rin=500Meg  ; pins IN+ IN- V+ V- OUT
XUpid4 N028 N027 15V -15V 2dof level.2 Avol=250k GBW=10Meg Slew=10Meg ilimit=25m rail=0 Vos=0 phimargin=45 en=0 enk=0 in=0 ink=0 Rin=500Meg  ; pins IN+ IN- V+ V- OUT
XUpid5 0 N017 15V -15V A1 level.2 Avol=250k GBW=10Meg Slew=10Meg ilimit=25m rail=0 Vos=0 phimargin=45 en=0 enk=0 in=0 ink=0 Rin=500Meg  ; pins IN+ IN- V+ V- OUT
XUpid1 0 N015 15V -15V prop level.2 Avol=250k GBW=10Meg Slew=10Meg ilimit=25m rail=0 Vos=0 phimargin=45 en=0 enk=0 in=0 ink=0 Rin=500Meg  ; pins IN+ IN- V+ V- OUT
B1 N010 0 V=if(time<2200,24,if(time>2200,if(time<2203,0,24),24))
B2 NC_02 0 V=7
V§U1 6.4V_ 0 6.4
Rbr5 bridge2_ 0 7.5k
Rbrs2 Vrt1_ Vrt2_ R=if(time<1000,5.4k,5.3k)
Rbr6 Vrt2_ 0 7.5k
Rbr7 N034 Vrt1_ 2.61k
V§U2 15V_ 0 15
V§Un1 -15V_ 0 -15
Rdiff7 N031 Vrt2_ 51k
Rdiff8 N032 bridge2_ 51k
Rdiff9 N032 0 210k
Rdiff10 A_ N031 210k
Rp6 A_ N037 2.2k
Rp7 N037 0 6.8k
Rp8 N038 N037 1Meg
Rp9 N038 N039 2.2k
Rp10 N039 0 4.7k
Rheat2 N035 Collector_ 60
V§Un2 24V_ 0 24
Rp11 Collector_ N042 47k
Rp12 N042 0 22k
Rp13 N043 N041 1000k
Rp14 0 N041 150k
Rp15 N040 N039 1k
Cp3 N042 N043 4.4µ
Cp4 N038 N037 0.1µ
Cdiff5 A_ N031 0.1µ
Cp5 N040 0 0.1µ
Eth2 VRTk_ 0 Collector_ 0 Laplace={kth_}/(180*s+1)*exp(-0.8*s)
Dbr2 0 N033 zbr1_
Rbrz2 N033 15V 1.5k
Rbr8 Vrt1_ bridge2_ R = limit(1k,30k,V(VRT_))
B3 N036 0 V=if(time<2200,24,if(time>2200,if(time<2203,0,24),24))
Qp2 Collector_ N040 0 0 bjtp1
XUdiff4 N032 N031 15V_ -15V_ A_ level.2 Avol=250k GBW=10Meg Slew=10Meg Ilimit=25m Rail=0 Vos={vdiffos_} en=0 enk=0 in=0 ink=0 Rin=500Meg  ; pins IN+ IN- V+ V- OUT
Vbr2 N034 0 6.4
Bnoise1 A+noise_ 0 V=1
XUp2 N041 N037 15V_ -15V_ N038 level.2 Avol=250k GBW=10Meg Slew=10Meg ilimit=25m rail=0 Vos=0 phimargin=45 en=0 enk=0 in=0 ink=0 Rin=500Meg  ; pins IN+ IN- V+ V- OUT
Bth1 VRT_ 0 V=V(VRTk_)+{ath_}
Idiff1 N031 0 {idiffin_}
Edistb3 N035 0 N036 0 Laplace=1/(1*s+1)
Edistb4 N007 0 N010 0 Laplace=1/(1*s+1)
.model D D
.lib standard.dio
.model NPN NPN
.model PNP PNP
.lib standard.bjt
.tran 0 3000 900
* Supply
* Power Block
* PID
.param kp=0.5*ku
.param kd=3*ku*tu/80
* .param ki=0.1*ku/tu/1
.param tu=0.5
.param ku=4.1
.param ki=3
* PreSet
;dc V1 1 20 0.1
.option abstol=1e-2
* .option cshunt=1e-13
.option gmin=1e-7
* .option reltol=0.0001
* .step param rd list 10k 1k
* .step param rinstr list 1k 5k 10k
* .model awp AKO:BZX384B6V2 (Bv=1.2)
* .step param rtest list 1k 2k
* .meas TRAN Rd AVG V(Vrt1,bridge2)/Ix(x1:1) FROM 800 TO 974
* .meas TRAN Rd2 AVG V(Vrt1,bridge2)/Ix(x1:1) FROM 1200 TO 1400
* .step param ros list 5k 10k 30k
* .step param rd list 200k 400k 500k 800k 1000k
* .step param rd list 10k 1k
* .step param ri list  20k 30k 40k 50k 80k
* .step param rp list   250k 300k 350k 400k 500k
* .step param r5 list 250k 150k 60k
.param noisetime 10
.param noiselevel 5000
* Noise
* Thermostat
.param kth =75
.param ath =4000
* Wheatstone Bridge
.model zbr1 AKO:BZX384B6V2 (Bv=6.42)
* Model Congig
.model bjtp1 AKO:TIP31C (Bf={bth}  ikf=0 )
.param bth =600
* Wheatstone Bridge
* Power Supply
* Input Diff Amplifier
* Thermostat
* Power Block
.model zbr1_ AKO:BZX384B6V2 (Bv=6.42)
.model bjtp1 AKO:TIP31C (Bf={bth_}  ikf=0 )
* Noise
.param noisetime_ 10
.param noiselevel_ 500
* V=white(time*{noisetime_})/{noiselevel_}*4+V(A_)
.param kth_ =75
.param ath_ =4000
.param bth_ =600
.param vdiffos_ =0
.param idiffin_ =0
* .step param kth_ list 67.5 75 82.5
* .step param rp11 list 22k 47k 100k
* .step param rp13 list 100k 500k 1000k
.param rbr4 4k
* .FUNC f_rd(x) {return limit(1k,30k,x)}
.lib UniversalOpamps2.sub
.backanno
.end